# Altium schematic sheet 7 Inch Module.SchDoc: 7" TFT LCD (part 3 of 3)
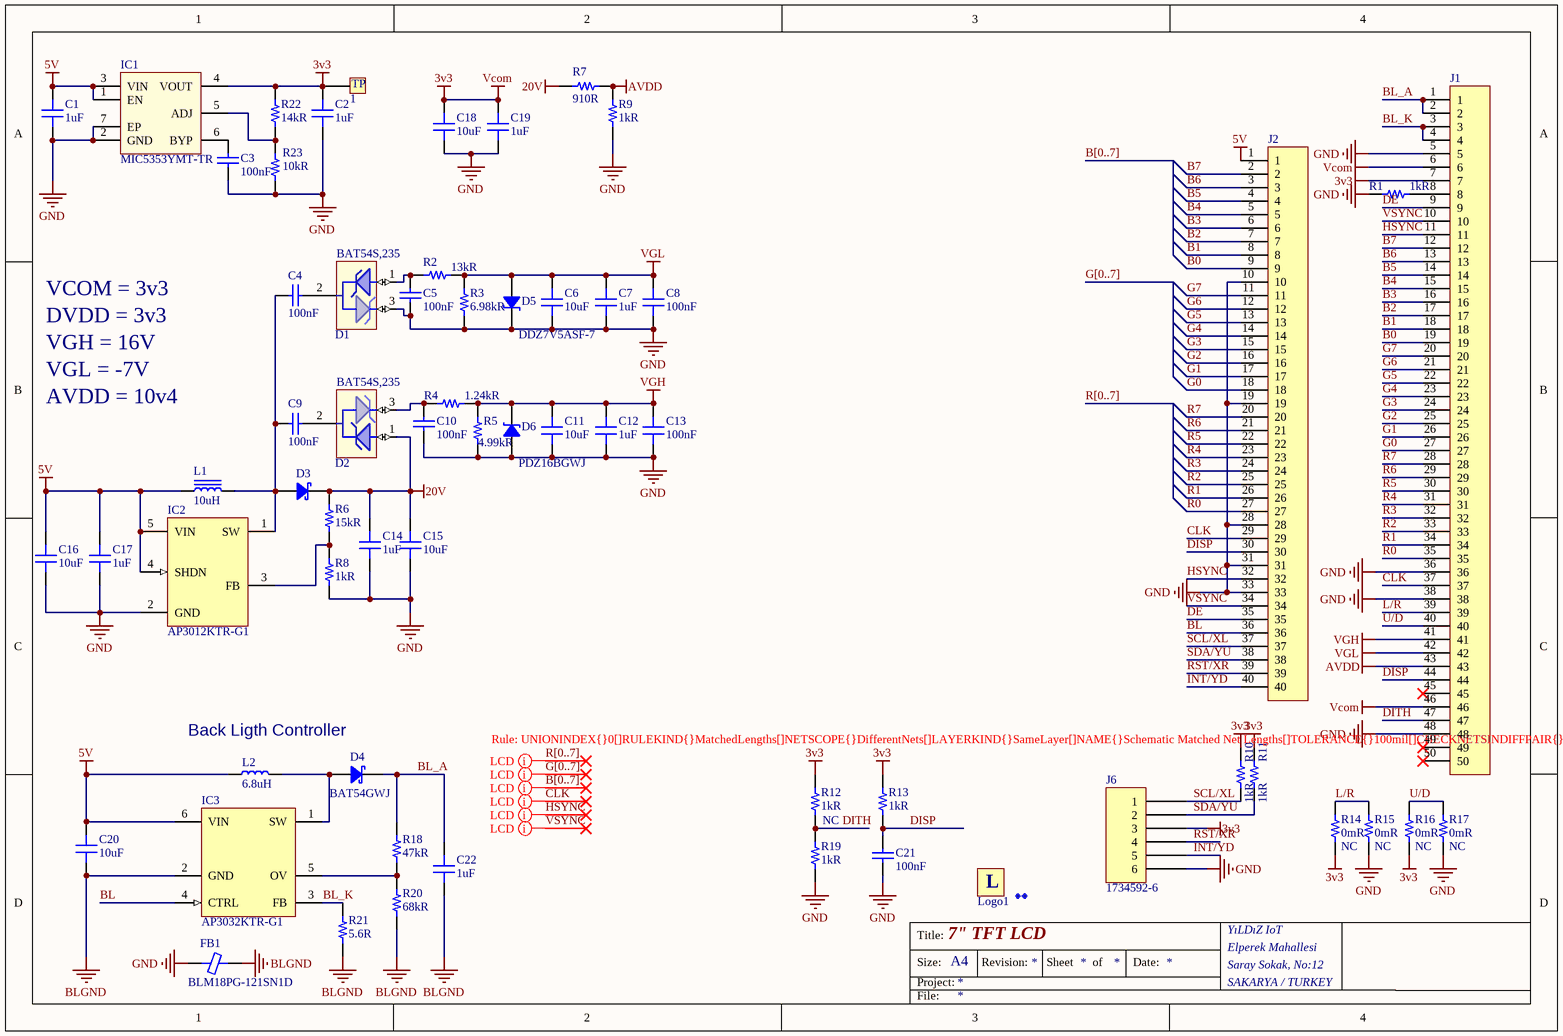
[diagram p2: 7 Inch Module.SchDoc]

## Library data of the parts (continued)
R6 = Resistor_Chip: Ceramic, SMT Capacitor; Manufacturer: Yageo; Manufacturer Part Number: RC0603FR-0715KL; Description: Res Thick Film 0603 15K Ohm 1% 1/10W ?100ppm/?C Molded SMD Paper T/R; Voltage Rating (DC): 50V; Temperature Coefficient: 100ppm/°C; Tolerance: 1%; Power Rating: 100mW; ComponentLink1URL: http://components.arrow.com/part/dataview/44987923S7569258N1174?src-supplier=Arrow; ComponentLink1Description: http://components.arrow.com/part/dataview/44987923S7569258N1174?src-supplier=Arrow; ComponentLink2URL: https://www.verical.com/server-webapp/html/getDatasheet?partID=738121&src-supplier=Verical; ComponentLink2Description: https://www.verical.com/server-webapp/html/getDatasheet?partID=738121&src-supplier=Verical; ComponentLink3URL: https://www.seielect.com/Catalog/SEI-RMCF_RMCP.pdf?src-supplier=Digi-Key; ComponentLink3Description: https://www.seielect.com/Catalog/SEI-RMCF_RMCP.pdf?src-supplier=Digi-Key; ComponentLink4URL: http://www.seielect.com/Catalog/SEI-RMC.pdf?src-supplier=Future+Electronics; ComponentLink4Description: http://www.seielect.com/Catalog/SEI-RMC.pdf?src-supplier=Future+Electronics; ComponentLink5URL: https://www.seielect.com/catalog/SEI-Packaging.pdf?src-supplier=Digi-Key; ComponentLink5Description: https://www.seielect.com/catalog/SEI-Packaging.pdf?src-supplier=Digi-Key; ComponentLink6URL: https://www.seielect.com/catalog/SEI-RMCF_RMCP.pdf?src-supplier=Avnet; ComponentLink6Description: https://www.seielect.com/catalog/SEI-RMCF_RMCP.pdf?src-supplier=Avnet; ComponentLink7URL: http://www.seielect.com/Catalog/SEI-RMCF_RMCP.pdf?src-supplier=Digi-Key; ComponentLink7Description: http://www.seielect.com/Catalog/SEI-RMCF_RMCP.pdf?src-supplier=Digi-Key; ComponentLink8URL: http://components.arrow.com/part/dataview/44987954S7631231N1174?src-supplier=Arrow; ComponentLink8Description: http://components.arrow.com/part/dataview/44987954S7631231N1174?src-supplier=Arrow; ComponentLink9URL: http://www.mouser.com/ds/2/447/RC0603-272842.pdf?src-supplier=Mouser; ComponentLink9Description: http://www.mouser.com/ds/2/447/RC0603-272842.pdf?src-supplier=Mouser; ComponentLink10URL: http://components.arrow.com/part/dataview/0323_03538290?src-supplier=Arrow+Europe; ComponentLink10Description: http://components.arrow.com/part/dataview/0323_03538290?src-supplier=Arrow+Europe; ComponentLink11URL: http://www.yageo.com/documents/recent/PYu-RC_Group_51_RoHS_L_9.pdf?src-supplier=Digi-Key; ComponentLink11Description: http://www.yageo.com/documents/recent/PYu-RC_Group_51_RoHS_L_9.pdf?src-supplier=Digi-Key; ComponentLink12URL: http://www.yageo.com/documents/recent/PYu-RC_Group_51_RoHS_L_10.pdf?src-supplier=Digi-Key; ComponentLink12Description: http://www.yageo.com/documents/recent/PYu-RC_Group_51_RoHS_L_10.pdf?src-supplier=Digi-Key; ComponentLink13URL: http://www.yageo.com/documents/recent/PYu-RC0603_51_RoHS_L_7.pdf?src-supplier=Future+Electronics; ComponentLink13Description: http://www.yageo.com/documents/recent/PYu-RC0603_51_RoHS_L_7.pdf?src-supplier=Future+Electronics; Supplier 1: Digi-Key; Supplier Part Number 1: 311-15.0KHRCT-ND; Stock 1: 3899647; Pricing 1: 1 = 0,10000, 10 = 0,02300, 100 = 0,00940, 1000 = 0,00421, 2500 = 0,00366 (USD); RoHS: Yes; Case/Package: 0603; Number of Pins: 2; Case Code (Metric): 1608; Case Code (Imperial): 0603; Min Operating Temperature: -55°C; Max Operating Temperature: 155°C; Resistance: 15kR; Packaging: Tape and Reel; Composition: Thick Film; Features: Moisture Resistant; Number of Terminations: 2; Termination: SMD/SMT; Military Standard: Not; Max Power Dissipation: 100mW; Package Quantity: 1; Voltage Rating: 50V; Length: 1.6mm; Height: 0.022inch; Width: 0.031inch; Depth: 0.8mm; Lead Free: Lead Free; REACH SVHC: Unknown; ComponentLink14URL: https://datasheet.ciiva.com/2453/pyu-r-int-thick-7-2453907.pdf?src-supplier=Digi-Key; ComponentLink14Description: https://datasheet.ciiva.com/2453/pyu-r-int-thick-7-2453907.pdf?src-supplier=Digi-Key; ComponentLink15URL: https://datasheet.ciiva.com/2453/pyu-r-int-thick-7-2453908.pdf?src-supplier=Digi-Key; ComponentLink15Description: https://datasheet.ciiva.com/2453/pyu-r-int-thick-7-2453908.pdf?src-supplier=Digi-Key; ComponentLink16URL: https://datasheet.ciiva.com/2453/pyu-r-int-thick-7-2453909.pdf?src-supplier=Digi-Key; ComponentLink16Description: https://datasheet.ciiva.com/2453/pyu-r-int-thick-7-2453909.pdf?src-supplier=Digi-Key; ComponentLink17URL: https://datasheet.ciiva.com/15189/getdatasheetpartid-327895-15189613.pdf?src-supplier=Verical; ComponentLink17Description: https://datasheet.ciiva.com/15189/getdatasheetpartid-327895-15189613.pdf?src-supplier=Verical
R7 = Resistor_Chip: Ceramic, SMT Capacitor; Manufacturer: Yageo; Manufacturer Part Number: RC0603FR-07910RL; Description: Thick Film Resistors - SMD 910 OHM 1%; Voltage Rating (DC): 50V; Tolerance: 1%; Max Power Dissipation: 100mW; Temperature Coefficient: 100ppm/°C; ComponentLink1URL: https://datasheet.ciiva.com/8890/pyu-rc0603-51-rohs-l-4-8890984.pdf?src-supplier=Avnet; ComponentLink1Description: https://datasheet.ciiva.com/8890/pyu-rc0603-51-rohs-l-4-8890984.pdf?src-supplier=Avnet; ComponentLink2URL: https://datasheet.ciiva.com/12577/rc0603-272842-12577401.pdf?src-supplier=Mouser; ComponentLink2Description: https://datasheet.ciiva.com/12577/rc0603-272842-12577401.pdf?src-supplier=Mouser; Supplier 1: Digi-Key; Supplier Part Number 1: 311-910HRCT-ND; Stock 1: 1223459; Pricing 1: 1 = 0,10000, 10 = 0,02300, 100 = 0,00940, 1000 = 0,00421, 2500 = 0,00366 (USD); RoHS: Yes; Case/Package: 0603; Case Code (Metric): 1608; Case Code (Imperial): 0603; Min Operating Temperature: -55°C; Max Operating Temperature: 155°C; Package Quantity: 1; Packaging: Tape and Reel; Features: Moisture Resistant; Resistance: 910R; Power Rating: 100mW; Voltage Rating: 50V; Composition: Thick Film; Number of Terminations: 2; Termination: SMD/SMT; Military Standard: Not; Length: 1.6mm; Height: 0.022inch; Width: 0.031inch; Depth: 0.8mm; Lead Free: Lead Free; ComponentLink3URL: https://datasheet.ciiva.com/2455/pyu-r-int-thick-7-2455284.pdf?src-supplier=Digi-Key; ComponentLink3Description: https://datasheet.ciiva.com/2455/pyu-r-int-thick-7-2455284.pdf?src-supplier=Digi-Key; ComponentLink4URL: https://datasheet.ciiva.com/2455/pyu-r-int-thick-7-2455286.pdf?src-supplier=Digi-Key; ComponentLink4Description: https://datasheet.ciiva.com/2455/pyu-r-int-thick-7-2455286.pdf?src-supplier=Digi-Key; ComponentLink5URL: https://datasheet.ciiva.com/12558/rc0603-272842-12558745.pdf?src-supplier=Mouser; ComponentLink5Description: https://datasheet.ciiva.com/12558/rc0603-272842-12558745.pdf?src-supplier=Mouser; ComponentLink6URL: https://datasheet.ciiva.com/2455/pyu-r-int-thick-7-2455285.pdf?src-supplier=Digi-Key; ComponentLink6Description: https://datasheet.ciiva.com/2455/pyu-r-int-thick-7-2455285.pdf?src-supplier=Digi-Key
R14-R17 = Resistor_Chip: Ceramic, SMT Capacitor; Manufacturer: Stackpole Electronics; Manufacturer Part Number: RMCF0603ZT0R00; Power Rating: 100mW; Current Rating: 1A; Working Voltage: 75V; Supplier 1: Digi-Key; Supplier Part Number 1: RMCF0603ZT0R00CT-ND; Stock 1: 3894946; Pricing 1: 1 = 0,10000, 10 = 0,01600, 25 = 0,01160, 50 = 0,00880, 100 = 0,00640, 250 = 0,00492, 500 = 0,00392, 1000 = 0,00289 (USD); RoHS: Yes; Mount: Surface Mount; Case/Package: 0603; Case Code (Metric): 1608; Case Code (Imperial): 0603; Contact Plating: Tin; Min Operating Temperature: -55°C; Max Operating Temperature: 155°C; Resistance: 0mR; Packaging: Tape and Reel; Composition: Thick Film; Number of Terminations: 2; Military Standard: Not; Max Power Dissipation: 100mW; Features: Automotive AEC-Q200; Length: 1.55mm; Height: 0.022inch; Width: 0.031inch; Depth: 0.8mm; Radiation Hardening: No; Lead Free: Lead Free; ComponentLink1URL: https://www.seielect.com/catalog/SEI-Packaging.pdf?src-supplier=Avnet; ComponentLink1Description: https://www.seielect.com/catalog/SEI-Packaging.pdf?src-supplier=Avnet; ComponentLink2URL: https://www.seielect.com/catalog/SEI-Packaging.pdf?src-supplier=Verical; ComponentLink2Description: https://www.seielect.com/catalog/SEI-Packaging.pdf?src-supplier=Verical; ComponentLink3URL: https://www.seielect.com/catalog/SEI-Packaging.pdf?src-supplier=Arrow; ComponentLink3Description: https://www.seielect.com/catalog/SEI-Packaging.pdf?src-supplier=Arrow; ComponentLink4URL: https://www.seielect.com/catalog/SEI-Packaging.pdf?src-supplier=Digi-Key; ComponentLink4Description: https://www.seielect.com/catalog/SEI-Packaging.pdf?src-supplier=Digi-Key; ComponentLink5URL: https://www.seielect.com/Catalog/SEI-RMCF_RMCP.pdf?src-supplier=Digi-Key; ComponentLink5Description: https://www.seielect.com/Catalog/SEI-RMCF_RMCP.pdf?src-supplier=Digi-Key; ComponentLink6URL: https://www.seielect.com/catalog/SEI-RMCF_RMCP.pdf?src-supplier=Avnet+Asia; ComponentLink6Description: https://www.seielect.com/catalog/SEI-RMCF_RMCP.pdf?src-supplier=Avnet+Asia; ComponentLink7URL: http://www.seielect.com/catalog/sei-rmc.pdf?src-supplier=Future+Electronics; ComponentLink7Description: http://www.seielect.com/catalog/sei-rmc.pdf?src-supplier=Future+Electronics; ComponentLink8URL: https://www.seielect.com/catalog/SEI-Packaging.pdf?src-supplier=Future+Electronics; ComponentLink8Description: https://www.seielect.com/catalog/SEI-Packaging.pdf?src-supplier=Future+Electronics; NC: NC
R18 = Resistor_Chip: Ceramic, SMT Capacitor; Manufacturer: Yageo; Manufacturer Part Number: RC0603FR-0747KL; Tolerance: 1%; Voltage Rating (DC): 50V; Temperature Coefficient: 100ppm/°C; Power Rating: 100mW; Supplier 1: Digi-Key; Supplier Part Number 1: 311-47.0KHRCT-ND; Stock 1: 12336896; Pricing 1: 1 = 0,10000, 10 = 0,02400, 100 = 0,00970, 1000 = 0,00437, 2500 = 0,00379 (USD); RoHS: Yes; Case/Package: 0603; Number of Pins: 2; Case Code (Metric): 1608; Case Code (Imperial): 0603; Min Operating Temperature: -55°C; Max Operating Temperature: 155°C; Packaging: Tape and Reel; Resistance: 47kR; Composition: Thick Film; Voltage Rating: 50V; Termination: SMD/SMT; Military Standard: Not; Package Quantity: 1; Number of Terminations: 2; Max Power Dissipation: 100mW; Features: Moisture Resistant; Length: 1.6mm; Height: 0.022inch; Width: 0.031inch; Depth: 0.8mm; REACH SVHC: Unknown; Lead Free: Lead Free; ComponentLink1URL: http://www.farnell.com/datasheets/443971.pdf?src-supplier=Element14; ComponentLink1Description: http://www.farnell.com/datasheets/443971.pdf?src-supplier=Element14; ComponentLink2URL: http://www.yageo.com/documents/recent/PYu-RC_Group_51_RoHS_L_10.pdf?src-supplier=Digi-Key; ComponentLink2Description: http://www.yageo.com/documents/recent/PYu-RC_Group_51_RoHS_L_10.pdf?src-supplier=Digi-Key
R20 = Resistor_Chip: Ceramic, SMT Capacitor; Manufacturer: Yageo; Manufacturer Part Number: RC0603FR-0768KL; Power Rating: 100mW; Tolerance: 1%; Voltage Rating: 50V; Temperature Coefficient: 100ppm/°C; Supplier 1: Digi-Key; Supplier Part Number 1: 311-68.0KHRCT-ND; Stock 1: 4262894; Pricing 1: 1 = 0,10000, 10 = 0,02400, 100 = 0,00970, 1000 = 0,00437, 2500 = 0,00379 (USD); RoHS: Yes; Case/Package: 0603; Number of Pins: 2; Case Code (Metric): 1608; Case Code (Imperial): 0603; Min Operating Temperature: -55°C; Max Operating Temperature: 155°C; Package Quantity: 1; Resistance: 68kR; Packaging: Tape and Reel; Voltage Rating (DC): 50V; Composition: Thick Film; Number of Terminations: 2; Termination: SMD/SMT; Max Power Dissipation: 100mW; Features: Moisture Resistant; Length: 0.063inch; Height: 0.022inch; Width: 0.031inch; Depth: 0.8mm; REACH SVHC: Unknown; Lead Free: Lead Free; ComponentLink1URL: http://www.yageo.com/documents/recent/PYu-RC_Group_51_RoHS_L_10.pdf?src-supplier=Digi-Key; ComponentLink1Description: http://www.yageo.com/documents/recent/PYu-RC_Group_51_RoHS_L_10.pdf?src-supplier=Digi-Key; ComponentLink2URL: http://documents.rs-components.com/techlib://itc_doclist_GB.htm?stockno=5048243&src-supplier=RSComponents; ComponentLink2Description: http://documents.rs-components.com/techlib://itc_doclist_GB.htm?stockno=5048243&src-supplier=RSComponents; ComponentLink3URL: http://www.yageo.com/documents/recent/PYu-RC_Group_51_RoHS_L_9.pdf?src-supplier=Digi-Key; ComponentLink3Description: http://www.yageo.com/documents/recent/PYu-RC_Group_51_RoHS_L_9.pdf?src-supplier=Digi-Key; ComponentLink4URL: http://www.farnell.com/datasheets/1868787.pdf?src-supplier=Element14; ComponentLink4Description: http://www.farnell.com/datasheets/1868787.pdf?src-supplier=Element14; ComponentLink5URL: http://www.farnell.com/datasheets/443971.pdf?src-supplier=Element14; ComponentLink5Description: http://www.farnell.com/datasheets/443971.pdf?src-supplier=Element14; ComponentLink6URL: http://www.farnell.com/datasheets/2167052.pdf?src-supplier=Element14; ComponentLink6Description: http://www.farnell.com/datasheets/2167052.pdf?src-supplier=Element14
R21 = Resistor_Chip: Ceramic, SMT Capacitor; Manufacturer: Rohm; Manufacturer Part Number: ESR18EZPJ5R6; Tolerance: 5%; Max Power Dissipation: 333mW; Temperature Coefficient: 200ppm/°C; Supplier 1: Digi-Key; Supplier Part Number 1: RHM5.6ICT-ND; Stock 1: 5182; Pricing 1: 1 = 0,16000, 10 = 0,13300, 100 = 0,05200, 1000 = 0,02178, 2500 = 0,01996 (USD); RoHS: Yes; Case/Package: 1206; Case Code (Metric): 3216; Case Code (Imperial): 1206; Min Operating Temperature: -55°C; Max Operating Temperature: 155°C; Package Quantity: 1; Packaging: Tape and Reel; Resistance: 5.6R; Composition: Thick Film; Number of Terminations: 2; Features: Automotive AEC-Q200; Length: 0.126inch; Height: 0.026inch; Width: 0.063inch; ComponentLink1URL: https://datasheet.ciiva.com/14924/esr-14924874.pdf?src-supplier=Digi-Key; ComponentLink1Description: https://datasheet.ciiva.com/14924/esr-14924874.pdf?src-supplier=Digi-Key; ComponentLink2URL: https://datasheet.ciiva.com/14930/esr-14930446.pdf?src-supplier=Digi-Key; ComponentLink2Description: https://datasheet.ciiva.com/14930/esr-14930446.pdf?src-supplier=Digi-Key
R22 = Resistor_Chip: Ceramic, SMT Capacitor; Manufacturer: Yageo; Manufacturer Part Number: RC0603FR-0714KL; Tolerance: 1%; Power Rating: 100mW; Voltage Rating: 75V; Temperature Coefficient: 100ppm/°C; Voltage Rating (DC): 50V; Supplier 1: Digi-Key; Supplier Part Number 1: 311-14.0KHRCT-ND; Stock 1: 622097; Pricing 1: 1 = 0,10000, 10 = 0,02300, 100 = 0,00940, 1000 = 0,00421, 2500 = 0,00366 (USD); RoHS: Yes; Case/Package: 0603; Weight: 7.1E-05oz; Case Code (Metric): 1608; Case Code (Imperial): 0603; Min Operating Temperature: -55°C; Max Operating Temperature: 155°C; Resistance: 14kR; Packaging: Tape and Reel; Package Quantity: 1; Max Power Dissipation: 100mW; Features: Moisture Resistant; Composition: Thick Film; Number of Terminations: 2; Termination: SMD/SMT; Military Standard: Not; Length: 1.6mm; Height: 0.022inch; Width: 0.031inch; Depth: 0.8mm; Lead Free: Lead Free; ComponentLink1URL: https://datasheet.ciiva.com/15189/getdatasheetpartid-325152-15189610.pdf?src-supplier=Verical; ComponentLink1Description: https://datasheet.ciiva.com/15189/getdatasheetpartid-325152-15189610.pdf?src-supplier=Verical; ComponentLink2URL: https://datasheet.ciiva.com/2455/pyu-r-int-thick-7-2455089.pdf?src-supplier=Digi-Key; ComponentLink2Description: https://datasheet.ciiva.com/2455/pyu-r-int-thick-7-2455089.pdf?src-supplier=Digi-Key; ComponentLink3URL: https://datasheet.ciiva.com/2455/pyu-r-int-thick-7-2455090.pdf?src-supplier=Digi-Key; ComponentLink3Description: https://datasheet.ciiva.com/2455/pyu-r-int-thick-7-2455090.pdf?src-supplier=Digi-Key; ComponentLink4URL: https://datasheet.ciiva.com/2455/pyu-r-int-thick-7-2455091.pdf?src-supplier=Digi-Key; ComponentLink4Description: https://datasheet.ciiva.com/2455/pyu-r-int-thick-7-2455091.pdf?src-supplier=Digi-Key
R23 = Resistor_Chip: Ceramic, SMT Capacitor; Manufacturer: Stackpole Electronics; Manufacturer Part Number: RNCP0603FTD10K0; Tolerance: 1%; Max Power Dissipation: 125mW; Temperature Coefficient: 100ppm/°C; Supplier 1: Digi-Key; Supplier Part Number 1: RNCP0603FTD10K0CT-ND; Stock 1: 183083; Pricing 1: 1 = 0,10000, 10 = 0,06700, 100 = 0,02730, 1000 = 0,01224, 2500 = 0,01063 (USD); RoHS: Yes; Mount: Surface Mount; Case/Package: 0603; Case Code (Metric): 1608; Case Code (Imperial): 0603; Contact Plating: Matte,Tin; Min Operating Temperature: -55°C; Max Operating Temperature: 155°C; Packaging: Tape and Reel; Resistance: 10kR; Composition: Thin Film; Number of Terminations: 2; Features: Anti-Sulfur,Moisture Resistant; Length: 0.059inch; Height: 0.02inch; Width: 0.031inch; Radiation Hardening: No; Lead Free: Lead Free